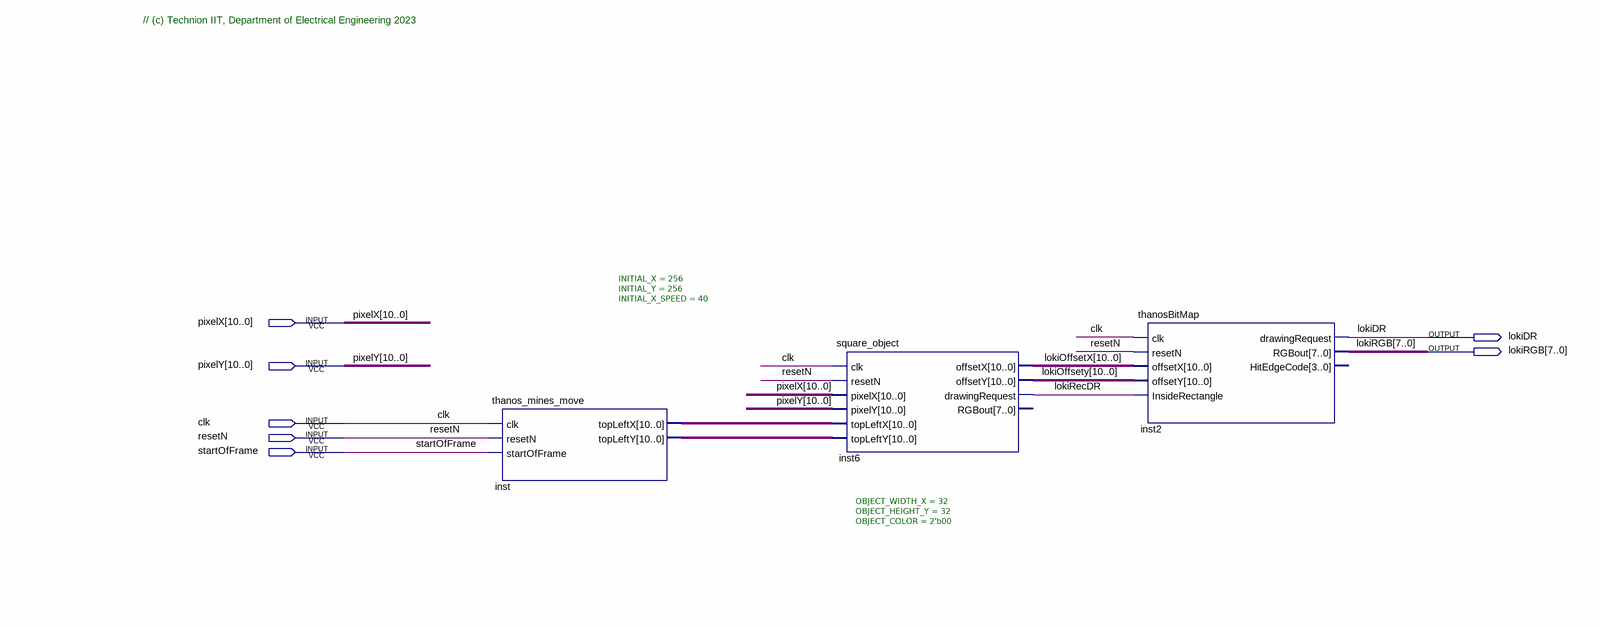
[diagram p0: schematic sheet]
// Quartus schematic thanos_Block_T.bdf as structural Verilog: 3 symbols, 7 pins
module thanos_Block_T (
  input  [10:0] pixelX,
  input  [10:0] pixelY,
  input  clk,
  input  resetN,
  input  startOfFrame,
  output lokiDR,
  output [7:0] lokiRGB
);

  wire lokiRecDR;
  wire [10:0] inst_topleftx, inst_toplefty, lokiOffsetX, lokiOffsety;

  thanos_mines_move #(.INITIAL_X(256), .INITIAL_Y(256), .INITIAL_X_SPEED(40)) inst (
    .clk(clk), .resetN(resetN), .startOfFrame(startOfFrame), .topLeftX(inst_topleftx),
    .topLeftY(inst_toplefty));
  square_object #(.OBJECT_WIDTH_X(32), .OBJECT_HEIGHT_Y(32), .OBJECT_COLOR(2'b00)) inst6 (
    .clk(clk), .resetN(resetN), .pixelX(pixelX), .pixelY(pixelY), .topLeftX(inst_topleftx),
    .topLeftY(inst_toplefty), .offsetX(lokiOffsetX), .offsetY(lokiOffsety), .drawingRequest(lokiRecDR));  // open: RGBout
  thanosBitMap inst2 (
    .clk(clk), .resetN(resetN), .offsetX(lokiOffsetX), .offsetY(lokiOffsety), .InsideRectangle(lokiRecDR),
    .drawingRequest(lokiDR), .RGBout(lokiRGB));  // open: HitEdgeCode

  // Notes on the sheet:
  //   // (c) Technion IIT, Department of Electrical Engineering 2023
endmodule
